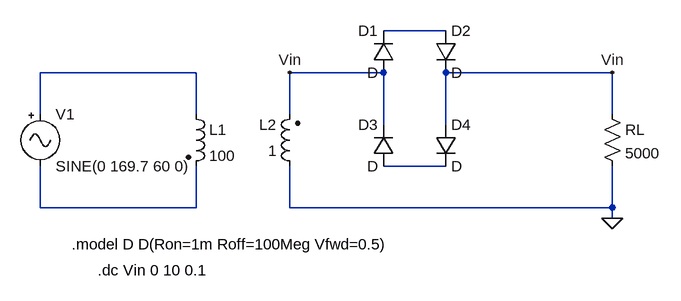
[diagram p0: schematic Exam 2 (Spring 2022) #1a.asc]
Exam 2 (Spring 2022) #1a.asc, the LTspice schematic file:
Version 4
SHEET 1 932 680
WIRE 592 80 496 80
WIRE 208 144 -32 144
WIRE 496 144 352 144
WIRE 848 144 592 144
WIRE -32 208 -32 144
WIRE 208 208 208 144
WIRE 352 208 352 144
WIRE 848 208 848 144
WIRE 496 224 496 144
WIRE 592 224 592 144
WIRE 592 288 496 288
WIRE -32 352 -32 288
WIRE 208 352 208 288
WIRE 208 352 -32 352
WIRE 352 352 352 288
WIRE 848 352 848 288
WIRE 848 352 352 352
WIRE 848 368 848 352
FLAG 848 368 0
FLAG 352 144 Vin
FLAG 848 144 Vin
SYMBOL Misc\\signal -32 192 R0
WINDOW 123 0 0 Left 0
WINDOW 39 0 0 Left 0
SYMATTR InstName V1
SYMATTR Value SINE(0 169.7 60 0)
SYMBOL ind2 192 192 R0
SYMATTR InstName L1
SYMATTR Value 100
SYMBOL ind2 368 304 R180
WINDOW 0 36 80 Left 2
WINDOW 3 36 40 Left 2
SYMATTR InstName L2
SYMATTR Value 1
SYMBOL diode 512 144 R180
WINDOW 0 24 64 Left 2
WINDOW 3 24 0 Left 2
SYMATTR InstName D1
SYMBOL diode 576 80 R0
SYMATTR InstName D2
SYMBOL diode 512 288 R180
WINDOW 0 24 64 Left 2
WINDOW 3 24 0 Left 2
SYMATTR InstName D3
SYMBOL diode 576 224 R0
SYMATTR InstName D4
SYMBOL res 832 192 R0
SYMATTR InstName RL
SYMATTR Value 5000
TEXT 16 408 Left 2 !.model D D(Ron=1m Roff=100Meg Vfwd=0.5)
TEXT 56 448 Left 2 !.dc Vin 0 10 0.1

The netlist it stands for:
* Exam 2 (Spring 2022) #1a.asc
V1 N002 N004 SINE(0 169.7 60 0)
L1 N002 N004 100
L2 0 Vin 1
D1 Vin N001 D
D2 N001 Vin D
D3 N003 Vin D
D4 Vin N003 D
RL Vin 0 5000
.model D D
.lib standard.dio
.model D D(Ron=1m Roff=100Meg Vfwd=0.5)
.dc Vin 0 10 0.1
.backanno
.end